# EAGLE design MachXO2_eval (EAGLE 7.5.0)
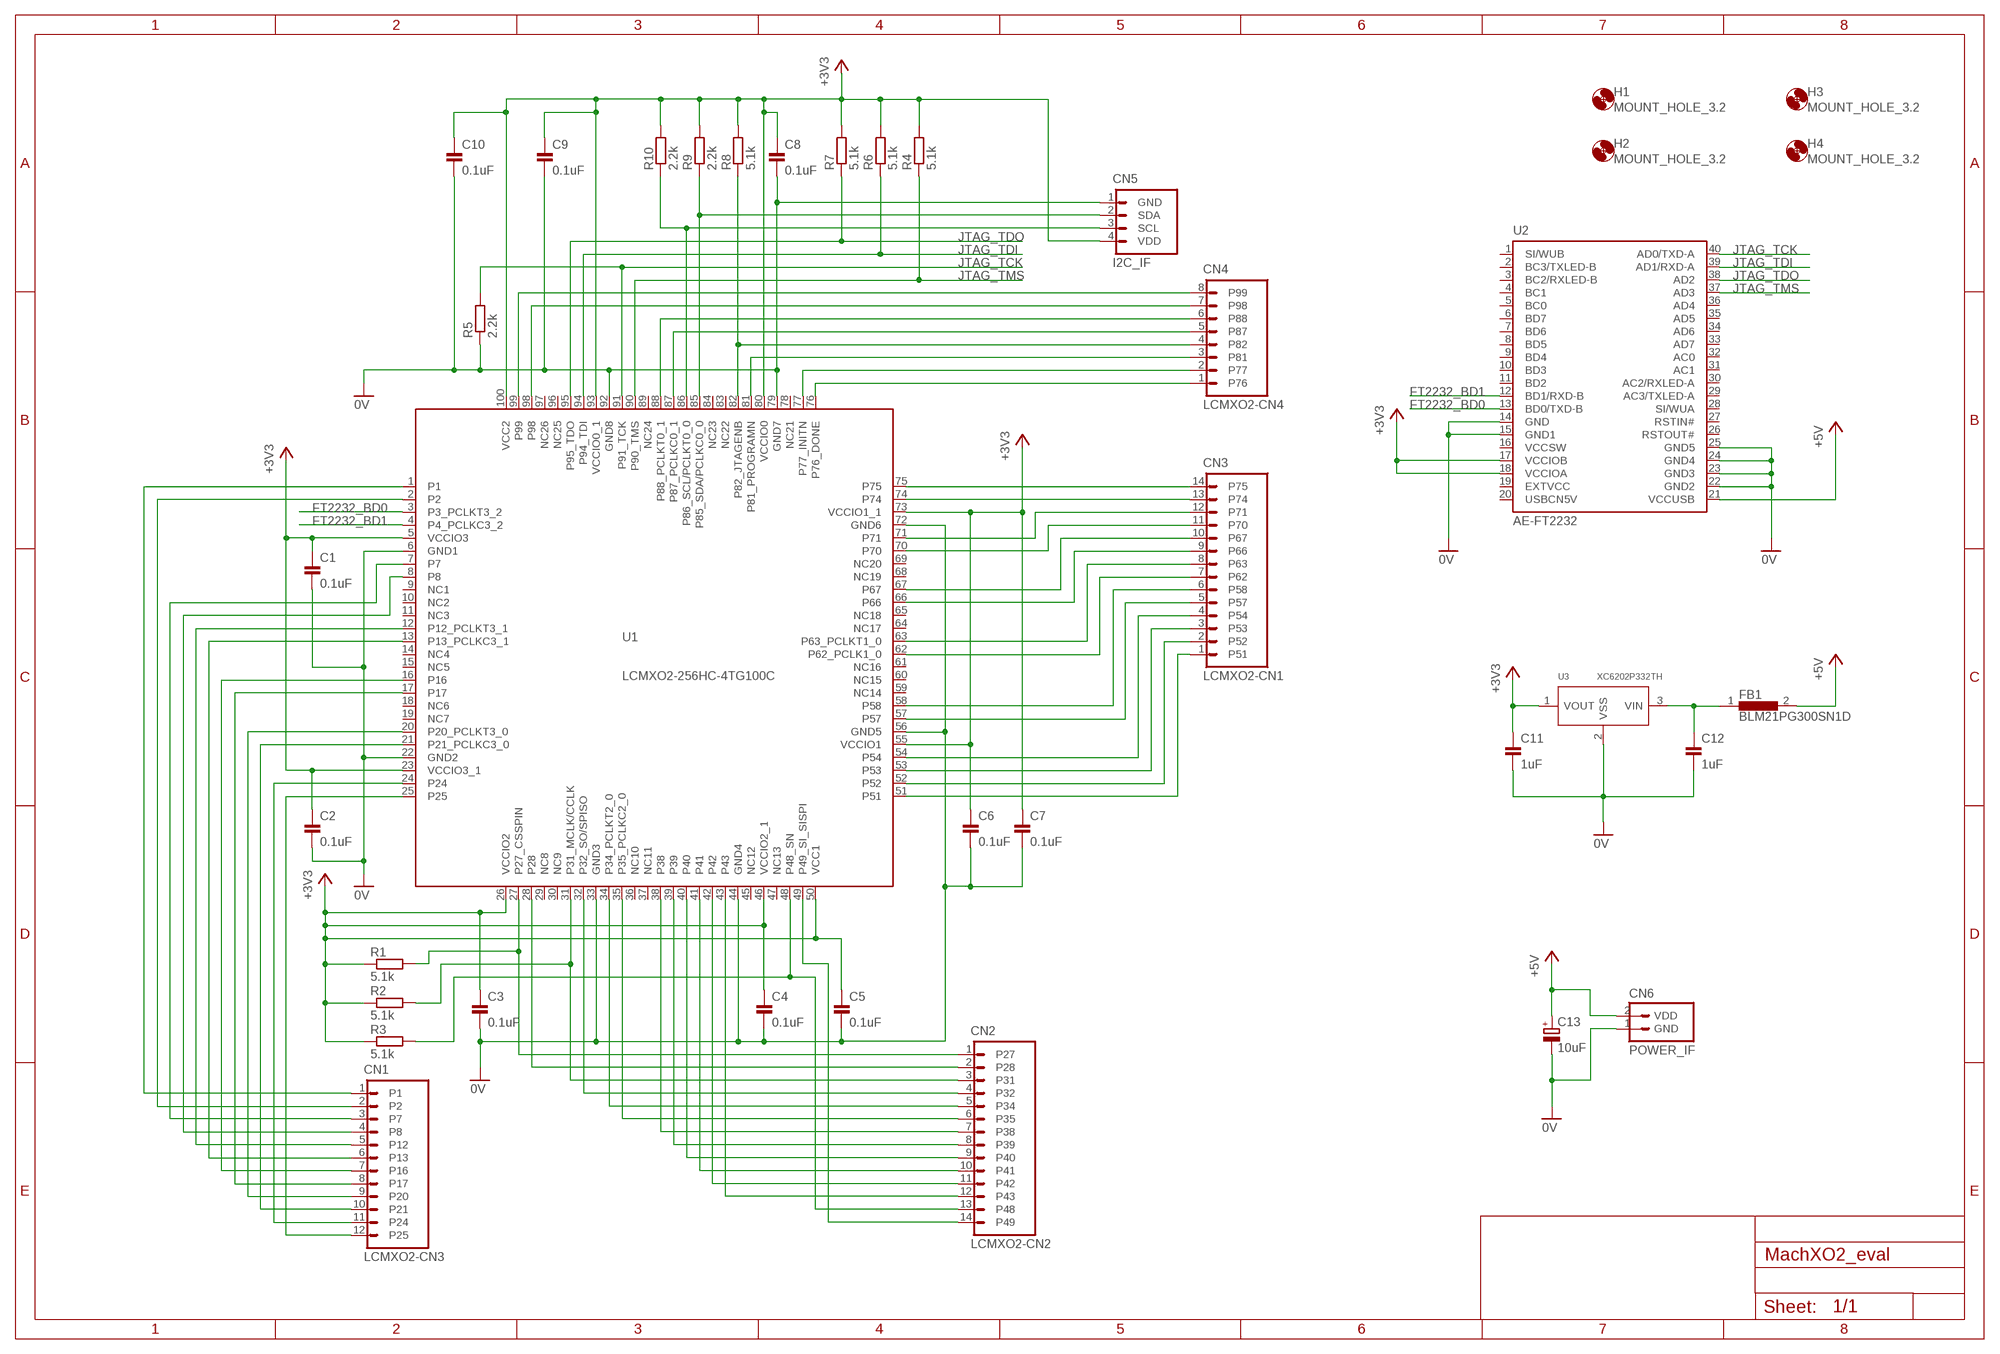
[diagram p0: schematic, sheet 1]

## Parts
C1  0.1uF  CAP_100MIL  [CAP_100MIL]
C2  0.1uF  CAP_100MIL  [CAP_100MIL]
C3  0.1uF  CAP_100MIL  [CAP_100MIL]
C4  0.1uF  CAP_100MIL  [CAP_100MIL]
C5  0.1uF  CAP_100MIL  [CAP_100MIL]
C6  0.1uF  CAP_100MIL  [CAP_100MIL]
C7  0.1uF  CAP_100MIL  [CAP_100MIL]
C8  0.1uF  CAP_100MIL  [CAP_100MIL]
C9  0.1uF  CAP_100MIL  [CAP_100MIL]
C10  0.1uF  CAP_100MIL  [CAP_100MIL]
C11  1uF  CAP_200MIL  [CAP_200MIL]
C12  1uF  CAP_200MIL  [CAP_200MIL]
C13  10uF  ELECAP_200MIL  [ELECAP_200MIL]
CN1  LCMXO2-CN3  [LCMXO2-CN-3]
CN2  LCMXO2-CN2  [LCMXO2-CN-2]
CN3  LCMXO2-CN1  [LCMXO2-CN-1]
CN4  LCMXO2-CN4  [LCMXO2-CN-4]
CN5  I2C_IF  [I2C_IF_4PIN]
CN6  POWER_IF  [HEADER_2PIN_POWER_IF]
FB1  BLM21PG300SN1D  [SMD_2012]
H1  MOUNT_HOLE_3.2  [3,2]
H2  MOUNT_HOLE_3.2  [3,2]
H3  MOUNT_HOLE_3.2  [3,2]
H4  MOUNT_HOLE_3.2  [3,2]
R1  5.1k  RESISTOR_200MIL  [RESISTOR_0204_200MIL]
R2  5.1k  RESISTOR_200MIL  [RESISTOR_0204_200MIL]
R3  5.1k  RESISTOR_200MIL  [RESISTOR_0204_200MIL]
R4  5.1k  RESISTOR_200MIL  [RESISTOR_0204_200MIL]
R5  2.2k  RESISTOR_200MIL  [RESISTOR_0204_200MIL]
R6  5.1k  RESISTOR_200MIL  [RESISTOR_0204_200MIL]
R7  5.1k  RESISTOR_200MIL  [RESISTOR_0204_200MIL]
R8  5.1k  RESISTOR_200MIL  [RESISTOR_0204_200MIL]
R9  2.2k  RESISTOR_200MIL  [RESISTOR_0204_200MIL]
R10  2.2k  RESISTOR_200MIL  [RESISTOR_0204_200MIL]
U1  LCMXO2-256HC-4TG100C  [QFP100-0.5MMPITCH]
U2  AE-FT2232  [DIL40]
U3  XC6202P332TH  [TO92-LINE]

## Nets
0V: C1.2 C2.2 C3.2 C4.2 C5.2 C6.2 C7.2 C8.2 C9.2 C10.2 C11.2 C12.2 C13.- CN5.1(GND) CN6.1(GND) R5.1 U1.6(GND1) U1.22(GND2) U1.33(GND3) U1.44(GND4) U1.56(GND5) U1.72(GND6) U1.79(GND7) U1.92(GND8) U2.14(GND) U2.15(GND1) U2.22(GND2) U2.23(GND3) U2.24(GND4) U2.25(GND5) U3.2(VSS)
+3V3: C1.1 C2.1 C3.1 C4.1 C5.1 C6.1 C7.1 C8.1 C9.1 C10.1 C11.1 CN5.4(VDD) R1.1 R2.1 R3.1 R4.2 R6.2 R7.2 R8.2 R9.2 R10.2 U1.5(VCCIO3) U1.23(VCCIO3_1) U1.26(VCCIO2) U1.46(VCCIO2_1) U1.50(VCC1) U1.55(VCCIO1) U1.73(VCCIO1_1) U1.80(VCCIO0) U1.93(VCCIO0_1) U1.100(VCC2) U2.17(VCCIOB) U2.18(VCCIOA) U3.1(VOUT)
+5V: C13.+ CN6.2(VDD) FB1.2 U2.21(VCCUSB)
FT2232_BD0: U1.3(P3_PCLKT3_2) U2.13(BD0/TXD-B)
FT2232_BD1: U1.4(P4_PCLKC3_2) U2.12(BD1/RXD-B)
I2C_SCL: CN5.3(SCL) R10.1 U1.86(P86_SCL/PCLKT0_0)
JTAG_TCK: R5.2 U1.91(P91_TCK) U2.40(AD0/TXD-A)
JTAG_TDI: R6.1 U1.94(P94_TDI) U2.39(AD1/RXD-A)
JTAG_TDO: R7.1 U1.95(P95_TDO) U2.38(AD2)
JTAG_TMS: R4.1 U1.90(P90_TMS) U2.37(AD3)
N$1: CN4.4(P82) R8.1 U1.82(P82_JTAGENB)
N$2: CN5.2(SDA) R9.1 U1.85(P85_SDA/PCLKC0_0)
N$3: CN2.1(P27) R1.2 U1.27(P27_CSSPIN)
N$4: CN3.4(P54) U1.54
N$5: CN3.3(P53) U1.53
N$6: CN3.10(P67) U1.67
N$7: CN3.9(P66) U1.66
N$8: CN2.3(P31) R2.2 U1.31(P31_MCLK/CCLK)
N$9: CN3.8(P63) U1.63(P63_PCLKT1_0)
N$10: CN2.13(P48) R3.2 U1.48(P48_SN)
N$11: CN3.5(P57) U1.57
N$12: CN3.6(P58) U1.58
N$13: CN3.7(P62) U1.62(P62_PCLK1_0)
N$14: CN2.14(P49) U1.49(P49_SI_SISPI)
N$15: CN3.2(P52) U1.52
N$16: CN3.1(P51) U1.51
N$17: CN2.12(P43) U1.43
N$18: CN2.11(P42) U1.42
N$19: CN2.10(P41) U1.41
N$20: CN2.9(P40) U1.40
N$21: CN2.8(P39) U1.39
N$22: CN2.7(P38) U1.38
N$23: CN3.13(P74) U1.74
N$24: CN2.6(P35) U1.35(P35_PCLKC2_0)
N$25: CN2.5(P34) U1.34(P34_PCLKT2_0)
N$26: CN2.4(P32) U1.32(P32_SO/SPISO)
N$27: CN2.2(P28) U1.28
N$28: CN3.11(P70) U1.70
N$29: CN3.12(P71) U1.71
N$30: CN3.14(P75) U1.75
N$31: CN4.1(P76) U1.76(P76_DONE)
N$32: CN4.2(P77) U1.77(P77_INITN)
N$33: C12.1 FB1.1 U3.3(VIN)
N$35: CN4.8(P99) U1.99
N$36: CN4.7(P98) U1.98
N$37: CN4.6(P88) U1.88(P88_PCLKT0_1)
N$38: CN4.5(P87) U1.87(P87_PCLKC0_1)
N$39: CN4.3(P81) U1.81(P81_PROGRAMN)
N$43: CN1.12(P25) U1.25
N$44: CN1.11(P24) U1.24
N$46: CN1.10(P21) U1.21(P21_PCLKC3_0)
N$47: CN1.9(P20) U1.20(P20_PCLKT3_0)
N$48: CN1.8(P17) U1.17
N$49: CN1.7(P16) U1.16
N$50: CN1.6(P13) U1.13(P13_PCLKC3_1)
N$51: CN1.5(P12) U1.12(P12_PCLKT3_1)
N$52: CN1.4(P8) U1.8
N$53: CN1.3(P7) U1.7
N$54: CN1.2 U1.2
N$55: CN1.1 U1.1
Unconnected: U1.9(NC1) U1.10(NC2) U1.11(NC3) U1.14(NC4) U1.15(NC5) U1.18(NC6) U1.19(NC7) U1.29(NC8) U1.30(NC9) U1.36(NC10) U1.37(NC11) U1.45(NC12) U1.47(NC13) U1.59(NC14) U1.60(NC15) U1.61(NC16) U1.64(NC17) U1.65(NC18) U1.68(NC19) U1.69(NC20) U1.78(NC21) U1.83(NC22) U1.84(NC23) U1.89(NC24) U1.96(NC25) U1.97(NC26) U2.1(SI/WUB) U2.2(BC3/TXLED-B) U2.3(BC2/RXLED-B) U2.4(BC1) U2.5(BC0) U2.6(BD7) U2.7(BD6) U2.8(BD5) U2.9(BD4) U2.10(BD3) U2.11(BD2) U2.16(VCCSW) U2.19(EXTVCC) U2.20(USBCN5V) U2.26(RSTOUT#) U2.27(RSTIN#) U2.28(SI/WUA) U2.29(AC3/TXLED-A) U2.30(AC2/RXLED-A) U2.31(AC1) U2.32(AC0) U2.33(AD7) U2.34(AD6) U2.35(AD5) U2.36(AD4)

## Library data of the parts
C1-C12 = Parts:CAP: コンデンサー
C13 = Parts:ELECAP: 電解コンデンサー
CN1 = PartsForProto:LCMXO2-CN3: LCMX02変換基板用I/Fピン-3
CN2 = PartsForProto:LCMXO2-CN2: LCMX02変換基板用I/Fピン-2
CN3 = PartsForProto:LCMXO2-CN1: LCMX02変換基板用I/Fピン-2
CN4 = PartsForProto:LCMXO2-CN4: LCMX02変換基板用I/Fピン-4
CN5 = PartsForProto:I2C_IF: I2C インターフェース
CN6 = PartsForProto:POWER_IF: 電源供給インターフェース
FB1 = Parts:BLM21PG: フェライトビーズ EMIFIL® 周波数あたりのインピーダンス : 30オーム @ 100MHz 電流定格（最大） : 4A DC抵抗（DCR）（最大）: 14ミリオーム 動作温度 : -55°C～125°C
H1-H4 = Generic:MOUNT_HOLE
R1-R10 = Parts:RESISTOR: 抵抗器
U1 = PartsForProto:LCMXO2-256HC-4TG100C: ＭａｃｈＸＯ２実装基板 ＬＣＭＸＯ２－２５６ＨＣ－４ＴＧ１００Ｃ(I-11003)を ２．５４ｍｍピッチに変換する基板に実装 ランク：ＨＣ高性能版 スピード：－４ ＬＡＢ数：３２ ＬＵＴ数：２５６ Ｉ／Ｏ数：５５ 分配ＲＡＭ：２Ｋｂｉｔ ハードウェアマクロ：Ｉ２Ｃｘ２、ＳＰＩｘ１、タイマーｘ１ 電源電圧：２．３７５ｖ－３．４６５ｖ ＩＯ電圧：１．１４ｖ－３．４６５ｖ
U2 = PartsForProto:AE-FT2232: ＦＴ２２３２Ｄ ＵＳＢ－シリアル２ｃｈ変換モジュール シリアル／パラレル混在動作も可能。 仮想ＣＯＭポートモードにより、Ｗｉｎｄｏｗｓ標準のＣＯＭポートが２ポート増設されます。 ■ＦＴ２２３２はＦＴ２３２とＦＴ２４５の機能２個が１チップに内蔵されています。 ■通信速度３００ｂｐｓ～１０００ｋｂｐｓ（ＲＳ２３２） ■３８４バイト受信バッファ、１２８バイト送信バッファ内蔵 ■ビットバングモードを各チャンネルで使用可能。 ■寸法：２０ｍｍｘ６０．３ｍｍｘ１８．７ｍｍ
U3 = Parts:XC6202*: 低損失ＣＭＯＳ三端子レギュレーター ・定格出力：５Ｖ ・最大出力電流：１５０ｍＡ以上 ・入力最大電圧：２０Ｖ ・入出力電圧差： ０．２Ｖ（３０ｍＡ時） ０．６７Ｖ（１００ｍＡ時） ・低消費電流：１０μＡ

## Board
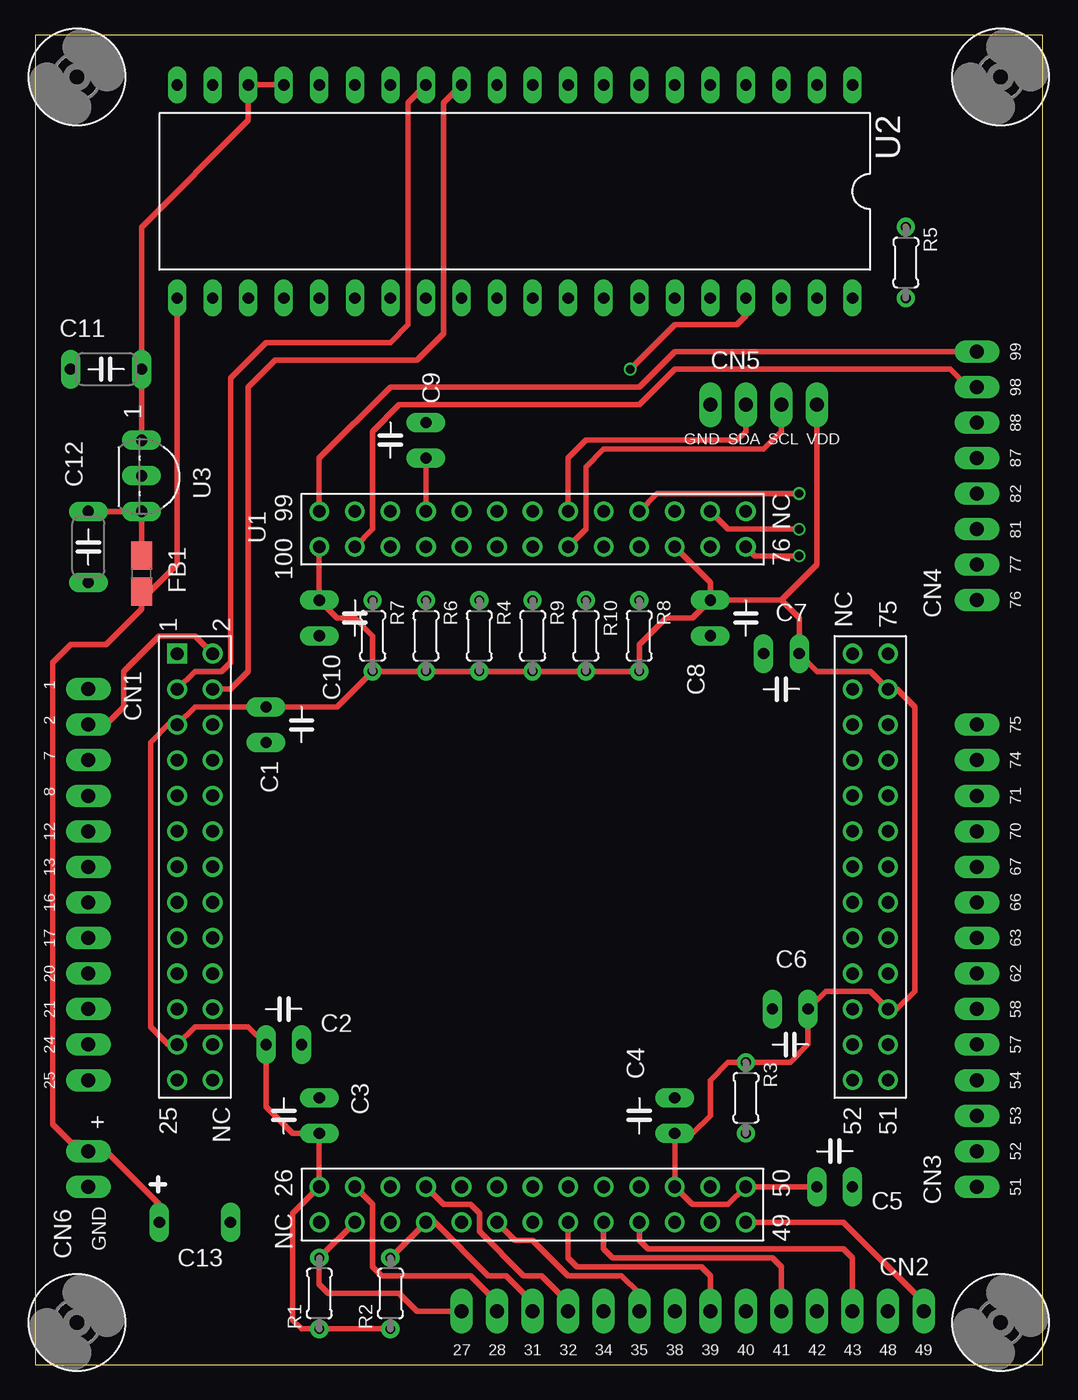
[diagram p1: board, top side]
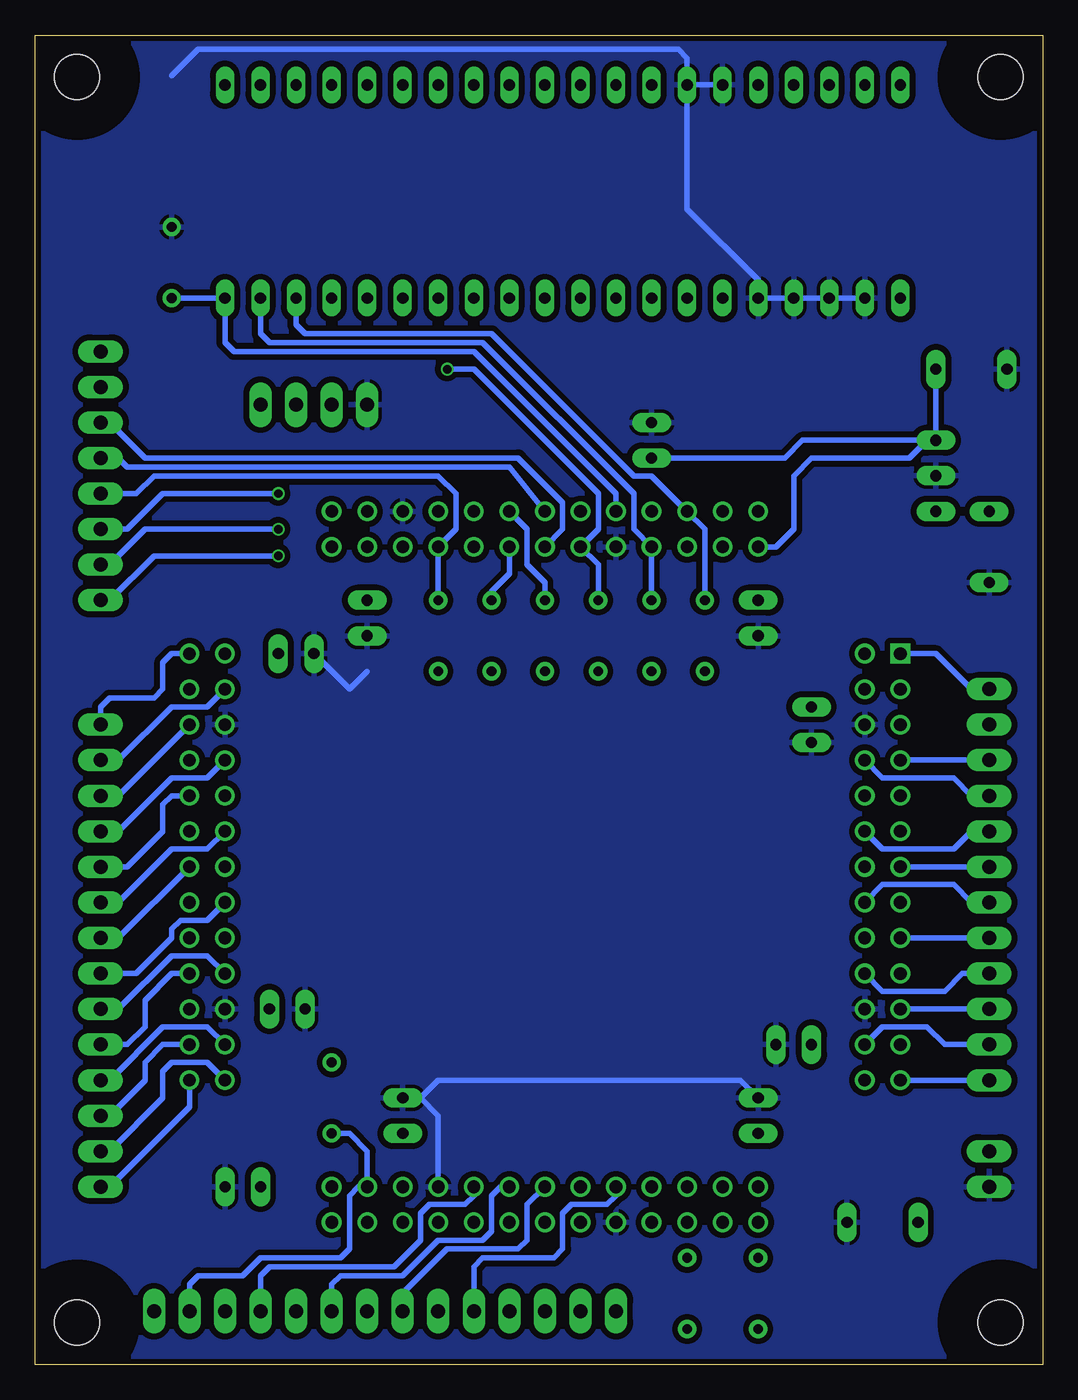
[diagram p2: board, bottom side, seen from below]

Size 72 x 95 mm. Coordinates in mm from the lower left corner, seen from the top.
Outline: 0,0 72,0 72,95 0,95 0,0
Copper layers (1*16): Top 0.035mm / dielectric 1.5mm / Bottom 0.035mm
Design rules "SeeedStudio_2layer_DRU_no_angle_20140221": minimum track width 6mil, minimum drill 12mil, track to track 6mil, track to pad 6mil, pad to pad 6mil, via to via 6mil, smd to smd 0mil, copper to edge 10mil, drill to drill 10mil, minimum pad ring 10mil, minimum via ring 6mil, stop-mask expansion 2mil, vias tented up to drill 100mil, thermal gap 10mil

### Footprints (pad centres in the part's own frame; a part is rotated, then mirrored left to right if it is on the bottom)
CAP_100MIL = drill 0.8 pad 1.4 long: 1 -1.27,0; 2 1.27,0
CAP_200MIL = drill 0.8 pad 1.4 long: 1 -2.54,0; 2 2.54,0
ELECAP_200MIL = drill 0.8 pad 1.4 long: + -1.27,0; - 3.81,0
LCMXO2-CN-3 = drill 1 pad 1.6 long: 1 0,0; 2 2.54,0; 3 5.08,0; 4 7.62,0; 5 10.16,0; 6 12.7,0; 7 15.24,0; 8 17.78,0; 9 20.32,0; 10 22.86,0; 11 25.4,0; 12 27.94,0
LCMXO2-CN-2 = drill 1 pad 1.6 long: 1 0,0; 2 2.54,0; 3 5.08,0; 4 7.62,0; 5 10.16,0; 6 12.7,0; 7 15.24,0; 8 17.78,0; 9 20.32,0; 10 22.86,0; 11 25.4,0; 12 27.94,0; 13 30.48,0; 14 33.02,0
LCMXO2-CN-1 = drill 1 pad 1.6 long: 1 0,0; 2 2.54,0; 3 5.08,0; 4 7.62,0; 5 10.16,0; 6 12.7,0; 7 15.24,0; 8 17.78,0; 9 20.32,0; 10 22.86,0; 11 25.4,0; 12 27.94,0; 13 30.48,0; 14 33.02,0
LCMXO2-CN-4 = drill 1 pad 1.6 long: 1 0,0; 2 2.54,0; 3 5.08,0; 4 7.62,0; 5 10.16,0; 6 12.7,0; 7 15.24,0; 8 17.78,0
I2C_IF_4PIN = drill 1 pad 1.6 long: 1 0,0; 2 2.54,0; 3 5.08,0; 4 7.62,0
HEADER_2PIN_POWER_IF = drill 1 pad 1.6 long: 1 0,0; 2 2.54,0
SMD_2012 = smd 2 x 1.5: 1 -1.3,0; 2 1.3,0
3,2 = hole 3.2: 0,0
RESISTOR_0204_200MIL = drill 0.7 pad 1.3: 1 -2.54,0; 2 2.54,0
QFP100-0.5MMPITCH = drill 0.9 square: 1 0,0 | drill 0.9: 2 0,2.54; 3 2.54,0; 4 2.54,2.54; 5 5.08,0; 6 5.08,2.54; 7 7.62,0; 8 7.62,2.54; 9 10.16,0; 10 10.16,2.54; 11 12.7,0; 12 12.7,2.54; 13 15.24,0; 14 15.24,2.54; 15 17.78,0; 16 17.78,2.54; 17 20.32,0; 18 20.32,2.54; 19 22.86,0; 20 22.86,2.54; 21 25.4,0; 22 25.4,2.54; 23 27.94,0; 24 27.94,2.54; 25 30.48,0; 26 38.1,10.16; 27 40.64,12.7; 28 38.1,12.7; 29 40.64,15.24; 30 38.1,15.24; 31 40.64,17.78; 32 38.1,17.78; 33 40.64,20.32; 34 38.1,20.32; 35 40.64,22.86; 36 38.1,22.86; 37 40.64,25.4; 38 38.1,25.4; 39 40.64,27.94; 40 38.1,27.94; 41 40.64,30.48; 42 38.1,30.48; 43 40.64,33.02; 44 38.1,33.02; 45 40.64,35.56; 46 38.1,35.56; 47 40.64,38.1; 48 38.1,38.1; 49 40.64,40.64; 50 38.1,40.64; 51 30.48,50.8; 52 30.48,48.26; 53 27.94,50.8; 54 27.94,48.26; 55 25.4,50.8; 56 25.4,48.26; 57 22.86,50.8; 58 22.86,48.26; 59 20.32,50.8; 60 20.32,48.26; 61 17.78,50.8; 62 17.78,48.26; 63 15.24,50.8; 64 15.24,48.26; 65 12.7,50.8; 66 12.7,48.26; 67 10.16,50.8; 68 10.16,48.26; 69 7.62,50.8; 70 7.62,48.26; 71 5.08,50.8; 72 5.08,48.26; 73 2.54,50.8; 74 2.54,48.26; 75 0,50.8; 76 -7.62,40.64; 77 -10.16,38.1; 78 -7.62,38.1; 79 -10.16,35.56; 80 -7.62,35.56; 81 -10.16,33.02; 82 -7.62,33.02; 83 -10.16,30.48; 84 -7.62,30.48; 85 -10.16,27.94; 86 -7.62,27.94; 87 -10.16,25.4; 88 -7.62,25.4; 89 -10.16,22.86; 90 -7.62,22.86; 91 -10.16,20.32; 92 -7.62,20.32; 93 -10.16,17.78; 94 -7.62,17.78; 95 -10.16,15.24; 96 -7.62,15.24; 97 -10.16,12.7; 98 -7.62,12.7; 99 -10.16,10.16; 100 -7.62,10.16; NC1 30.48,2.54; NC2 40.64,10.16; NC3 0,48.26; NC4 -10.16,40.64
DIL40 = drill 0.813 long: 1 -24.13,-7.62; 2 -21.59,-7.62; 3 -19.05,-7.62; 4 -16.51,-7.62; 5 -13.97,-7.62; 6 -11.43,-7.62; 7 -8.89,-7.62; 8 -6.35,-7.62; 9 -3.81,-7.62; 10 -1.27,-7.62; 11 1.27,-7.62; 12 3.81,-7.62; 13 6.35,-7.62; 14 8.89,-7.62; 15 11.43,-7.62; 16 13.97,-7.62; 17 16.51,-7.62; 18 19.05,-7.62; 19 21.59,-7.62; 20 24.13,-7.62; 21 24.13,7.62; 22 21.59,7.62; 23 19.05,7.62; 24 16.51,7.62; 25 13.97,7.62; 26 11.43,7.62; 27 8.89,7.62; 28 6.35,7.62; 29 3.81,7.62; 30 1.27,7.62; 31 -1.27,7.62; 32 -3.81,7.62; 33 -6.35,7.62; 34 -8.89,7.62; 35 -11.43,7.62; 36 -13.97,7.62; 37 -16.51,7.62; 38 -19.05,7.62; 39 -21.59,7.62; 40 -24.13,7.62
TO92-LINE = drill 0.8 pad 1.4 long: 1 0,0; 2 2.54,0; 3 5.08,0

### Placement (x,y rotation side)
C1  16.51,45.72 270 top
C2  17.78,22.86 0 top
C3  20.32,17.78 90 top
C4  45.72,17.78 90 top
C5  57.15,12.7 0 top
C6  53.98,25.4 180 top
C7  53.34,50.8 180 top
C8  48.26,53.34 270 top
C9  27.94,66.04 90 top
C10  20.32,53.34 270 top
C11  5.08,71.12 180 top
C12  3.81,58.42 270 top
C13  10.16,10.16 0 top
CN1  3.81,48.26 270 top
CN2  30.48,3.81 0 top
CN3  67.31,12.7 90 top
CN4  67.31,54.61 90 top
CN5  48.26,68.58 0 top
CN6  3.81,12.7 90 top
FB1  7.62,56.52 270 top
H1  3,3 0 top
H2  69,3 0 top
H3  69,92 0 top
H4  3,92 0 top
R1  20.32,5.08 90 top
R2  25.4,5.08 90 top
R3  50.8,19.05 270 top
R4  31.75,52.07 270 top
R5  62.23,78.74 270 top
R6  27.94,52.07 270 top
R7  24.13,52.07 270 top
R8  43.18,52.07 270 top
R9  35.56,52.07 270 top
R10  39.37,52.07 270 top
U1  10.16,50.8 270 top
U2  34.29,83.82 180 top
U3  7.62,66.04 270 top

### Tracks (layer width: path | path; a pad name or v marks a point on that pad's centre or on a via)
0V
  Bottom 0.406: U2.22 U2.23 U2.24 U2.25 20.32,77.47 25.4,82.55 U2.14 | U2.15 U2.14 | U1.44 43.18,17.78 44.45,19.05 | C4.2 44.45,19.05 | 44.45,19.05 43.18,20.32 21.59,20.32 C3.2 | C7.2 49.53,48.26 48.26,49.53 | 62.23,92.08 60.33,93.98 26.04,93.98 25.4,93.34 U2.14
  pour Bottom (isolate 0.406): -0.64,95.25 72.39,95.25 72.39,-0.64 -0.64,-0.64
+3V3
  Top 0.406: U3.1 C11.1 7.62,81.28 15.24,88.9 U2.18 U2.17 | R7.2 R6.2 R4.2 R9.2 R10.2 R8.2 43.18,51.44 45.09,53.34 46.99,53.34 C8.1 | 53.34,54.61 54.61,53.34 C7.1 55.88,49.53 59.69,49.53 U1.73 61.59,48.26 62.87,46.99 62.87,26.67 61.59,25.4 U1.55 59.69,26.67 56.52,26.67 C6.1 55.24,22.86 53.98,21.59 R3.1 49.53,21.59 48.26,20.32 48.26,17.78 46.99,16.51 C4.1 U1.46 46.99,11.43 49.53,11.43 U1.50 C5.1 | C8.1 53.34,54.61 | C9.1 U1.93 | U1.100 C10.1 21.59,53.34 22.86,53.34 24.13,52.07 R7.2 | 53.34,54.61 55.88,57.15 CN5.4 | C8.1 48.26,55.88 U1.80 | R2.1 R1.1 19.05,2.54 18.41,3.17 18.41,10.79 U1.26 C3.1 18.41,16.51 16.51,18.41 C2.1 15.24,24.13 11.43,24.13 U1.23 9.53,22.86 8.26,24.13 8.26,44.45 9.53,45.72 U1.5 11.43,46.99 C1.1 21.59,46.99 R7.2
  Bottom 0.406: 7.62,66.67 U3.1 17.14,66.04 18.41,64.77 C9.1 | 7.62,66.67 C11.1 | U1.100 19.05,58.42 17.78,59.69 17.78,63.5 16.51,64.77 9.53,64.77 7.62,66.67
+5V
  Top 0.406: U2.21 10.16,57.15 8.22,55.22 FB1.2 7.62,53.98 5.08,51.44 2.54,51.44 1.27,50.16 1.27,17.14 2.54,15.88 3.17,15.88 CN6.2 5.08,15.24 8.89,11.43 C13.+
FT2232_BD0
  Top 0.406: U1.3 11.43,49.53 13.34,49.53 13.97,50.16 13.97,70.48 16.51,73.03 25.4,73.03 26.67,74.3 26.67,90.17 U2.13
FT2232_BD1
  Top 0.406: U1.4 13.97,48.26 15.24,49.53 15.24,69.85 17.14,71.75 27.3,71.75 29.21,73.66 29.21,90.17 U2.12
I2C_SCL
  Top 0.406: CN5.3 53.34,66.67 52.07,65.41 40.64,65.41 39.37,64.14 39.37,59.69 U1.86
  Bottom 0.406: R10.1 39.37,55.24 38.1,56.52 U1.86
JTAG_TCK
  Bottom 0.406: R5.2 U2.40 58.42,73.03 57.78,72.39 40.64,72.39 30.48,62.23 U1.91
JTAG_TDI
  Bottom 0.406: R6.1 U1.94 29.21,59.69 29.21,62.23 40.01,73.03 55.24,73.03 55.88,73.66 U2.39
JTAG_TDO
  Bottom 0.406: R7.1 24.13,59.69 U1.95 27.94,63.5 29.21,63.5 39.37,73.66 52.7,73.66 53.34,74.3 U2.38
JTAG_TMS  (via drill 0.6)
  Top 0.406: U2.37 50.8,74.93 50.16,74.3 45.72,74.3 v42.55,71.12
  Bottom 0.406: R4.1 31.75,57.15 U1.90 31.75,59.69 31.75,62.23 40.64,71.12 v42.55,71.12
N$1
  Bottom 0.406: R8.1 U1.82 41.91,59.69 41.91,62.23 43.18,63.5 63.5,63.5 64.77,62.23 CN4.4
N$2
  Top 0.406: U1.85 38.1,64.77 39.37,66.04 50.16,66.04 50.8,66.67 CN5.2
  Bottom 0.406: R9.1 35.56,55.88 36.83,57.15 36.83,59.69 U1.85
N$3
  Top 0.406: CN2.1 27.3,3.81 26.04,5.08 20.95,5.08 20.32,5.71 R1.2 U1.27
N$4
  Bottom 0.406: CN3.4 66.67,20.32 62.87,24.13 59.69,24.13 U1.54
N$5
  Bottom 0.406: CN3.3 66.67,17.78 64.14,20.32 64.14,21.59 62.87,22.86 U1.53
N$6
  Bottom 0.406: CN3.10 65.41,35.56 62.87,38.1 62.87,40.01 62.23,40.64 U1.67
N$7
  Bottom 0.406: CN3.9 66.04,33.02 62.23,36.83 59.69,36.83 U1.66
N$8
  Top 0.406: R2.2 U1.31 28.57,10.16 32.38,6.35 33.66,6.35 35.56,4.45 CN2.3
N$9
  Bottom 0.406: CN3.8 66.04,30.48 U1.63
N$10
  Bottom 0.406: R3.2 49.53,16.51 48.26,15.24 U1.48 48.9,12.7 49.53,12.06 49.53,8.26 50.16,7.62 55.88,7.62 57.15,6.35 60.33,6.35 60.96,5.71 CN2.13
N$11
  Bottom 0.406: U1.57 62.23,27.94 64.14,26.04 64.14,24.13 65.41,22.86 CN3.5
N$12
  Bottom 0.406: CN3.6 66.04,25.4 62.23,29.21 59.69,29.21 U1.58
N$13
  Bottom 0.406: CN3.7 64.77,27.94 62.23,30.48 62.23,31.11 61.59,31.75 59.69,31.75 U1.62
N$14
  Top 0.406: CN2.14 63.5,4.45 57.78,10.16 U1.49
N$15
  Bottom 0.406: CN3.2 66.67,15.24 62.87,19.05 62.87,20.95 62.23,21.59 59.69,21.59 U1.52
N$16
  Bottom 0.406: CN3.1 66.67,12.7 60.96,18.41 U1.51
N$17
  Top 0.406: U1.43 43.18,8.89 43.81,8.26 57.78,8.26 58.42,7.62 CN2.12
N$18
  Bottom 0.406: U1.42 40.64,12.06 41.27,11.43 43.81,11.43 44.45,10.79 44.45,8.89 46.35,6.99 55.24,6.99 55.88,6.35 CN2.11
N$19
  Top 0.406: U1.41 40.64,8.26 41.27,7.62 52.7,7.62 53.34,6.99 CN2.10
N$20
  Bottom 0.406: U1.40 38.73,12.7 39.37,12.06 39.37,9.53 40.01,8.89 43.18,8.89 45.72,6.35 50.16,6.35 50.8,5.71 CN2.9
N$21
  Top 0.406: U1.39 38.1,7.62 38.73,6.99 47.62,6.99 48.26,6.35 CN2.8
N$22
  Bottom 0.406: U1.38 36.83,11.43 36.83,8.89 37.47,8.26 42.55,8.26 45.72,5.08 CN2.7
N$23
  Bottom 0.406: CN3.13 66.04,43.18 62.23,46.99 59.69,46.99 U1.74
N$24
  Top 0.406: CN2.6 43.18,5.08 41.91,6.35 38.1,6.35 35.56,8.89 34.29,8.89 U1.35
N$25
  Bottom 0.406: CN2.5 40.64,6.99 40.01,7.62 34.92,7.62 34.29,8.26 34.29,10.79 33.66,11.43 31.11,11.43 30.48,12.06 U1.34
N$26
  Top 0.406: U1.32 29.21,11.43 31.11,11.43 31.75,10.79 31.75,9.53 34.92,6.35 36.2,6.35 38.1,4.45 CN2.4
N$27
  Top 0.406: CN2.2 33.02,4.45 31.11,6.35 24.77,6.35 24.13,6.99 24.13,11.43 U1.28
N$28
  Bottom 0.406: CN3.11 66.04,38.1 62.23,41.91 59.69,41.91 U1.70
N$29
  Bottom 0.406: CN3.12 66.04,40.64 U1.71
N$30
  Bottom 0.406: CN3.14 67.31,46.99 66.67,47.62 63.5,47.62 62.87,48.26 62.87,50.16 62.23,50.8 U1.75
N$31  (via drill 0.6)
  Top 0.406: U1.76 51.44,57.78 v54.61,57.78
  Bottom 0.406: v54.61,57.78 63.5,57.78 66.67,54.61 CN4.1
N$32  (via drill 0.6)
  Top 0.406: U1.77 49.53,59.69 v54.61,59.69
  Bottom 0.406: v54.61,59.69 64.14,59.69 66.67,57.15 CN4.2
N$33
  Top 0.406: FB1.1 U3.3 C12.1
N$35
  Top 0.406: CN4.8 45.72,72.39 43.18,69.85 25.4,69.85 20.32,64.77 U1.99
N$36
  Top 0.406: U1.98 24.13,59.69 24.13,66.67 26.04,68.58 43.18,68.58 45.72,71.12 65.41,71.12 66.67,69.85 CN4.7
N$37
  Bottom 0.406: U1.88 34.29,59.69 34.29,61.59 37.47,64.77 64.14,64.77 66.67,67.31 CN4.6
N$38
  Bottom 0.406: CN4.5 66.04,64.77 65.41,64.14 38.1,64.14 U1.87
N$39  (via drill 0.6)
  Top 0.406: U1.81 44.45,62.23 v54.61,62.23
  Bottom 0.406: v54.61,62.23 62.87,62.23 65.41,59.69 CN4.3
N$43
  Bottom 0.406: CN1.12 U1.25
N$44
  Bottom 0.406: CN1.11 6.99,22.86 8.26,24.13 11.43,24.13 U1.24
N$46
  Bottom 0.406: CN1.10 U1.21
N$47
  Bottom 0.406: U1.20 11.43,26.67 6.99,26.67 5.71,27.94 CN1.9
N$48
  Bottom 0.406: CN1.8 U1.17
N$49
  Bottom 0.406: U1.16 11.43,34.29 6.35,34.29 5.08,33.02 CN1.7
N$50
  Bottom 0.406: CN1.6 U1.13
N$51
  Bottom 0.406: U1.12 11.43,36.83 6.35,36.83 5.08,38.1 CN1.5
N$52
  Bottom 0.406: CN1.4 5.08,40.64 6.35,41.91 11.43,41.91 U1.8
N$53
  Bottom 0.406: CN1.3 U1.7
N$54
  Top 0.406: U1.2 11.43,52.07 8.89,52.07 6.35,49.53 6.35,46.99 5.08,45.72 CN1.2
N$55
  Bottom 0.406: CN1.1 5.08,48.26 7.62,50.8 U1.1